# Altium project jetson-orin-baseboard.PrjPcb (part 1 of 5)
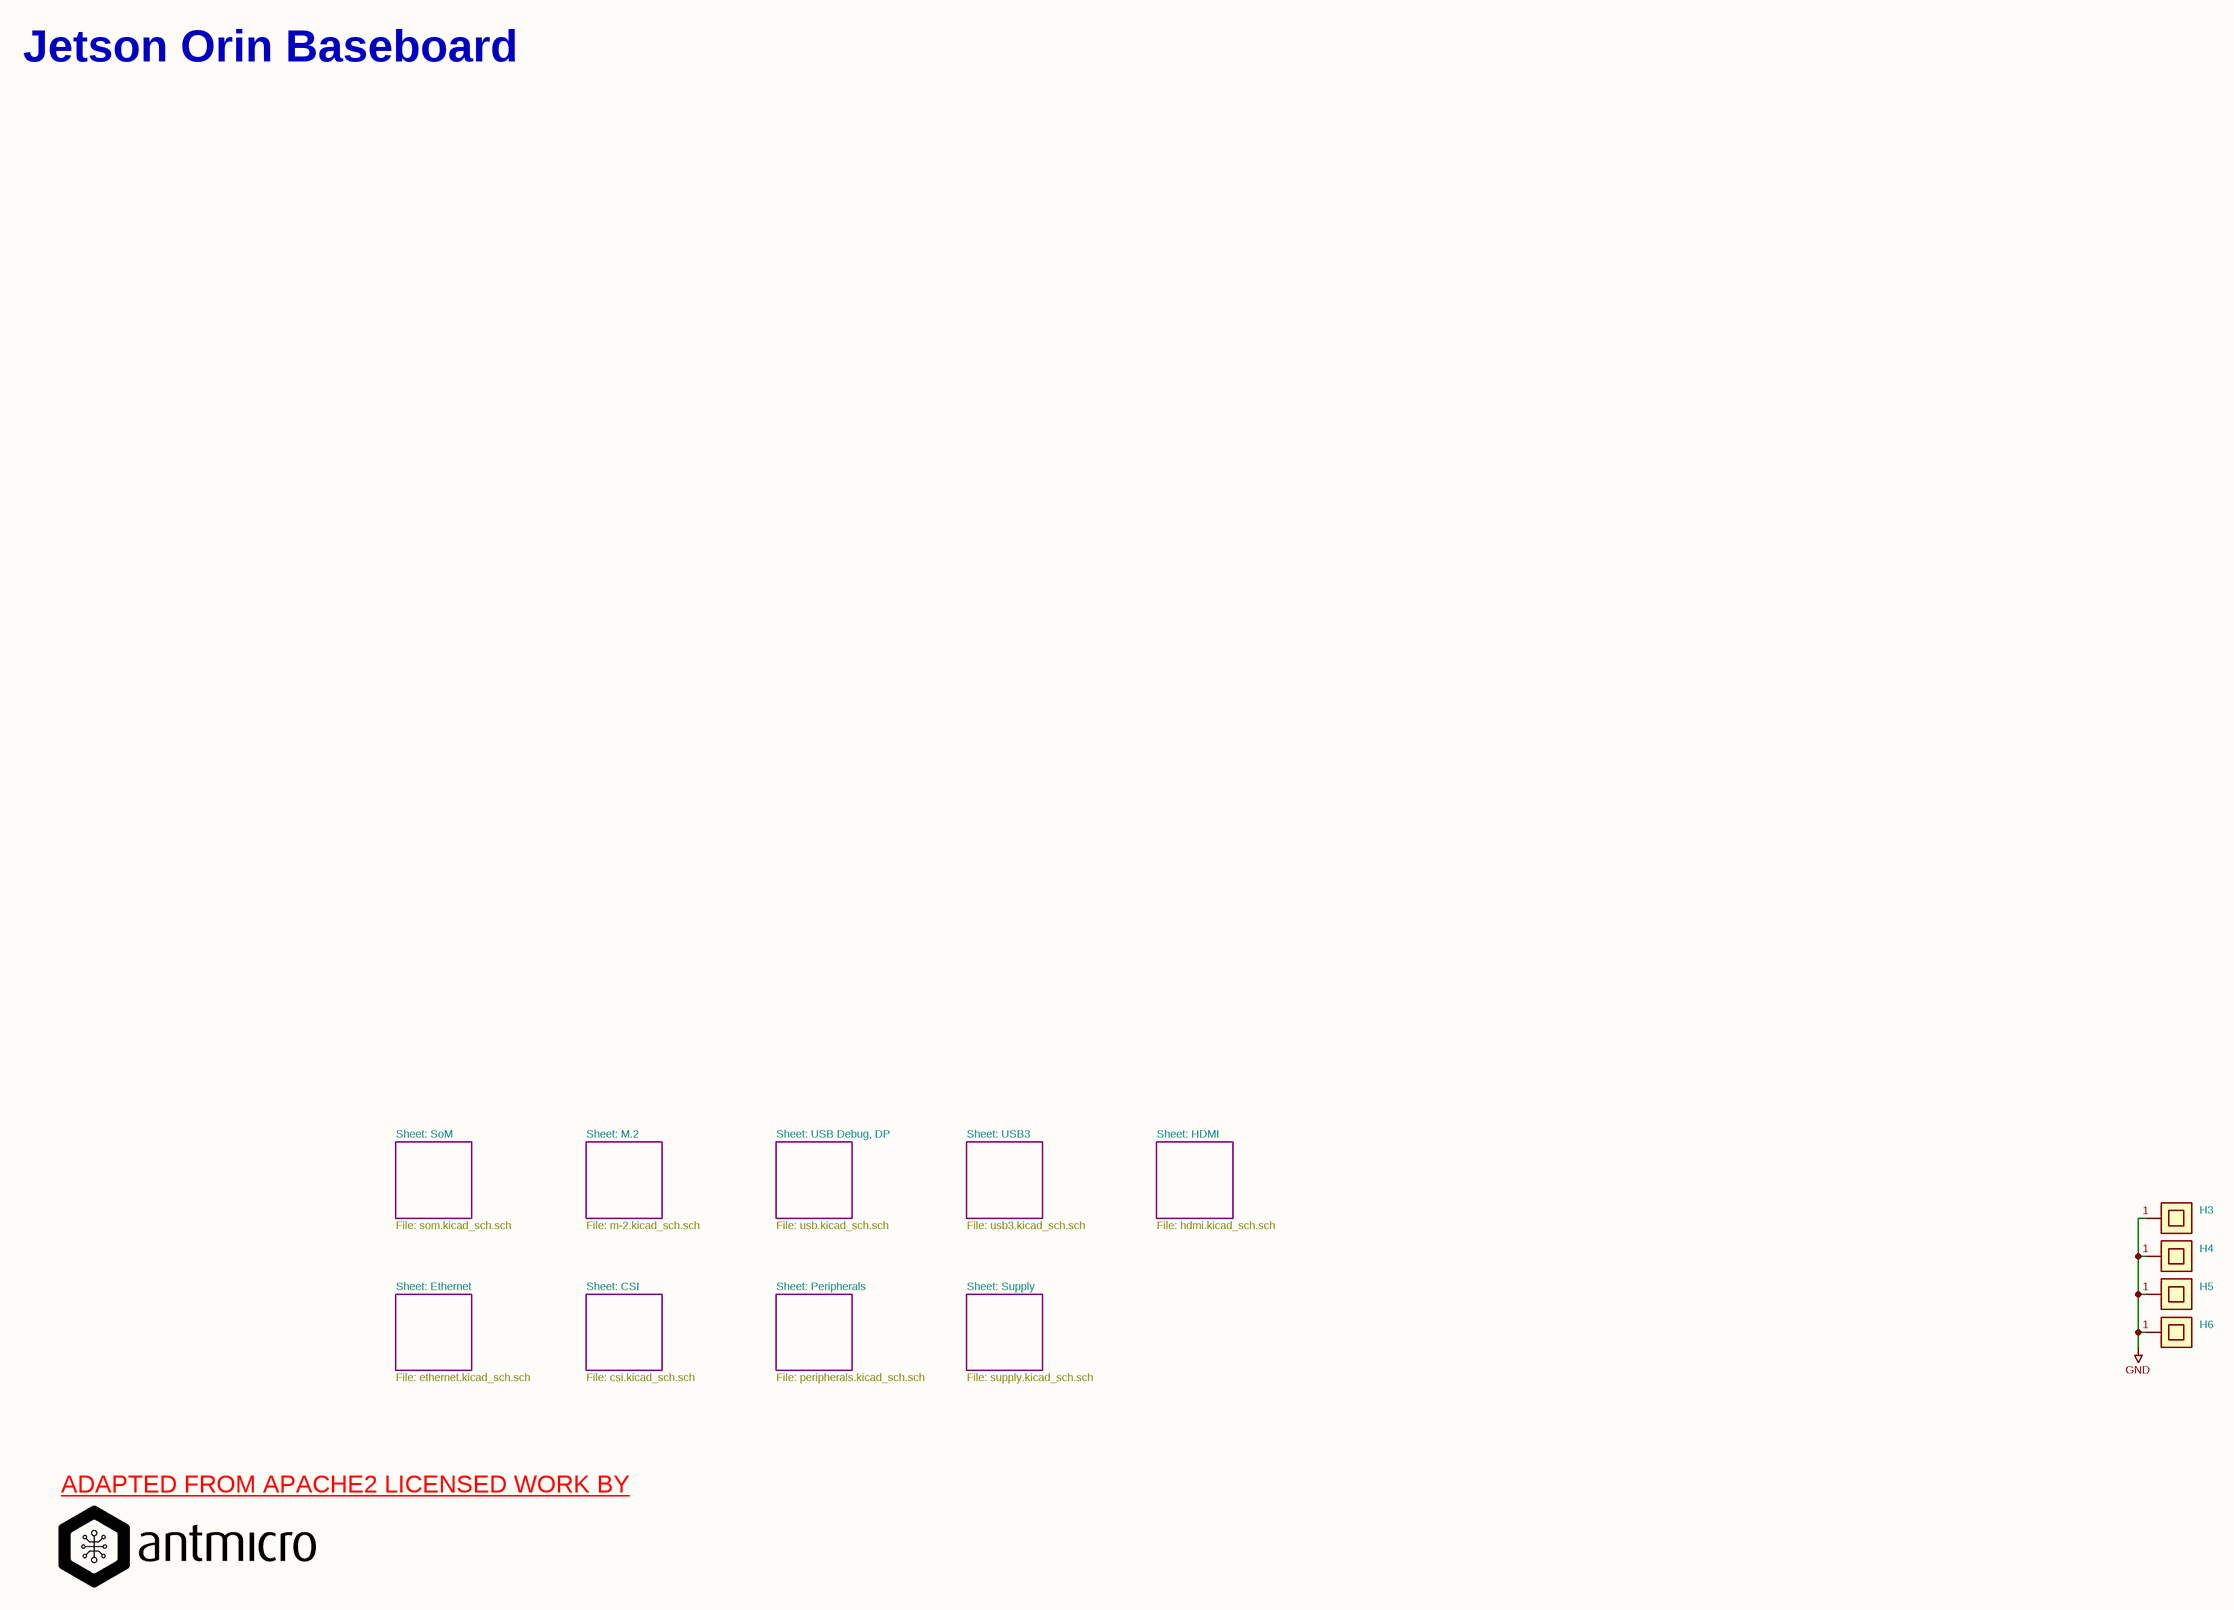
[diagram p0: jetson-orin-baseboard.SchDoc]
10 sheets, 674 parts. Net scope: flat (ports and power ports of the same name join across sheets).
Board file: jetson-orin-baseboard.PcbDoc
Sheets:
  jetson-orin-baseboard.SchDoc
    HDMI = hdmi.SchDoc
    USB3 = usb3.SchDoc
    Supply = supply.SchDoc
    SoM = som.SchDoc
    CSI = csi.SchDoc
    M.2 = m-2.SchDoc
    Ethernet = ethernet.SchDoc
    Peripherals = peripherals.SchDoc
    USB Debug, DP = usb.SchDoc

## Sheet jetson-orin-baseboard.SchDoc
size 420 x 297 mm

### Parts
H3  9774065151R  [Spacer_Drill3.7mm_H6.5mm_9774065151R]  (value not drawn)
H4  9774065151R  [Spacer_Drill3.7mm_H6.5mm_9774065151R]  (value not drawn)
H5  9774065151R  [Spacer_Drill3.7mm_H6.5mm_9774065151R]  (value not drawn)
H6  9774065151R  [Spacer_Drill3.7mm_H6.5mm_9774065151R]  (value not drawn)

### Sub-sheets
CSI = csi.SchDoc: no entries
Ethernet = ethernet.SchDoc: no entries
HDMI = hdmi.SchDoc: no entries
M.2 = m-2.SchDoc: no entries
Peripherals = peripherals.SchDoc: no entries
SoM = som.SchDoc: no entries
Supply = supply.SchDoc: no entries
USB3 = usb3.SchDoc: no entries
USB Debug, DP = usb.SchDoc: no entries

### Nets
GND: H3.1 H4.1 H5.1 H6.1

### Notes on the sheet
- Jetson Orin Baseboard
- Sheet: SoM
- Sheet: M.2
- Sheet: USB Debug, DP
- Sheet: USB3
- Sheet: HDMI
- File: som.kicad_sch.sch
- File: m-2.kicad_sch.sch
- File: usb.kicad_sch.sch
- File: usb3.kicad_sch.sch
- File: hdmi.kicad_sch.sch
- Sheet: Ethernet
- Sheet: CSI
- Sheet: Peripherals
- Sheet: Supply
- File: ethernet.kicad_sch.sch
- File: csi.kicad_sch.sch
- File: peripherals.kicad_sch.sch
- File: supply.kicad_sch.sch
- ADAPTED FROM APACHE2 LICENSED WORK BY <https://github.com/antmicro/jetson-orin-baseboard>
- 1
- 2
- 3
- 4
- 5
- 6
- 7
- 8
- A
- B
- C
- D
- E
- www.antmicro.com <http://www.antmicro.com>
- Title: Jetson Orin Baseboard
- File: jetson-orin-baseboard.kicad_sch
- Sheet: /
- Antmicro Ltd
- F
- KiCad E.D.A.  kicad (5.1.4)-1
- Size: A3
- Date: 2025-01-15
- Rev: 1.3.0
- Id: 1/1

### Library data of the parts
H3-H6 = Spacer_Drill3.7mm_H6.5mm_9774065151R: Manufacturer 1: Würth Elektronik; License: Apache-2.0; Author: Antmicro; OldValue: Spacer_Drill3.7mm_H6.5mm_9774065151R; Manufacturer Part Number 1: 9774065151R; Value: 9774065151R; Footprint: antmicro-footprints:Spacer_Drill3.7mm_H6.5mm_9774065151R

## Sheet hdmi.SchDoc
size 420 x 297 mm
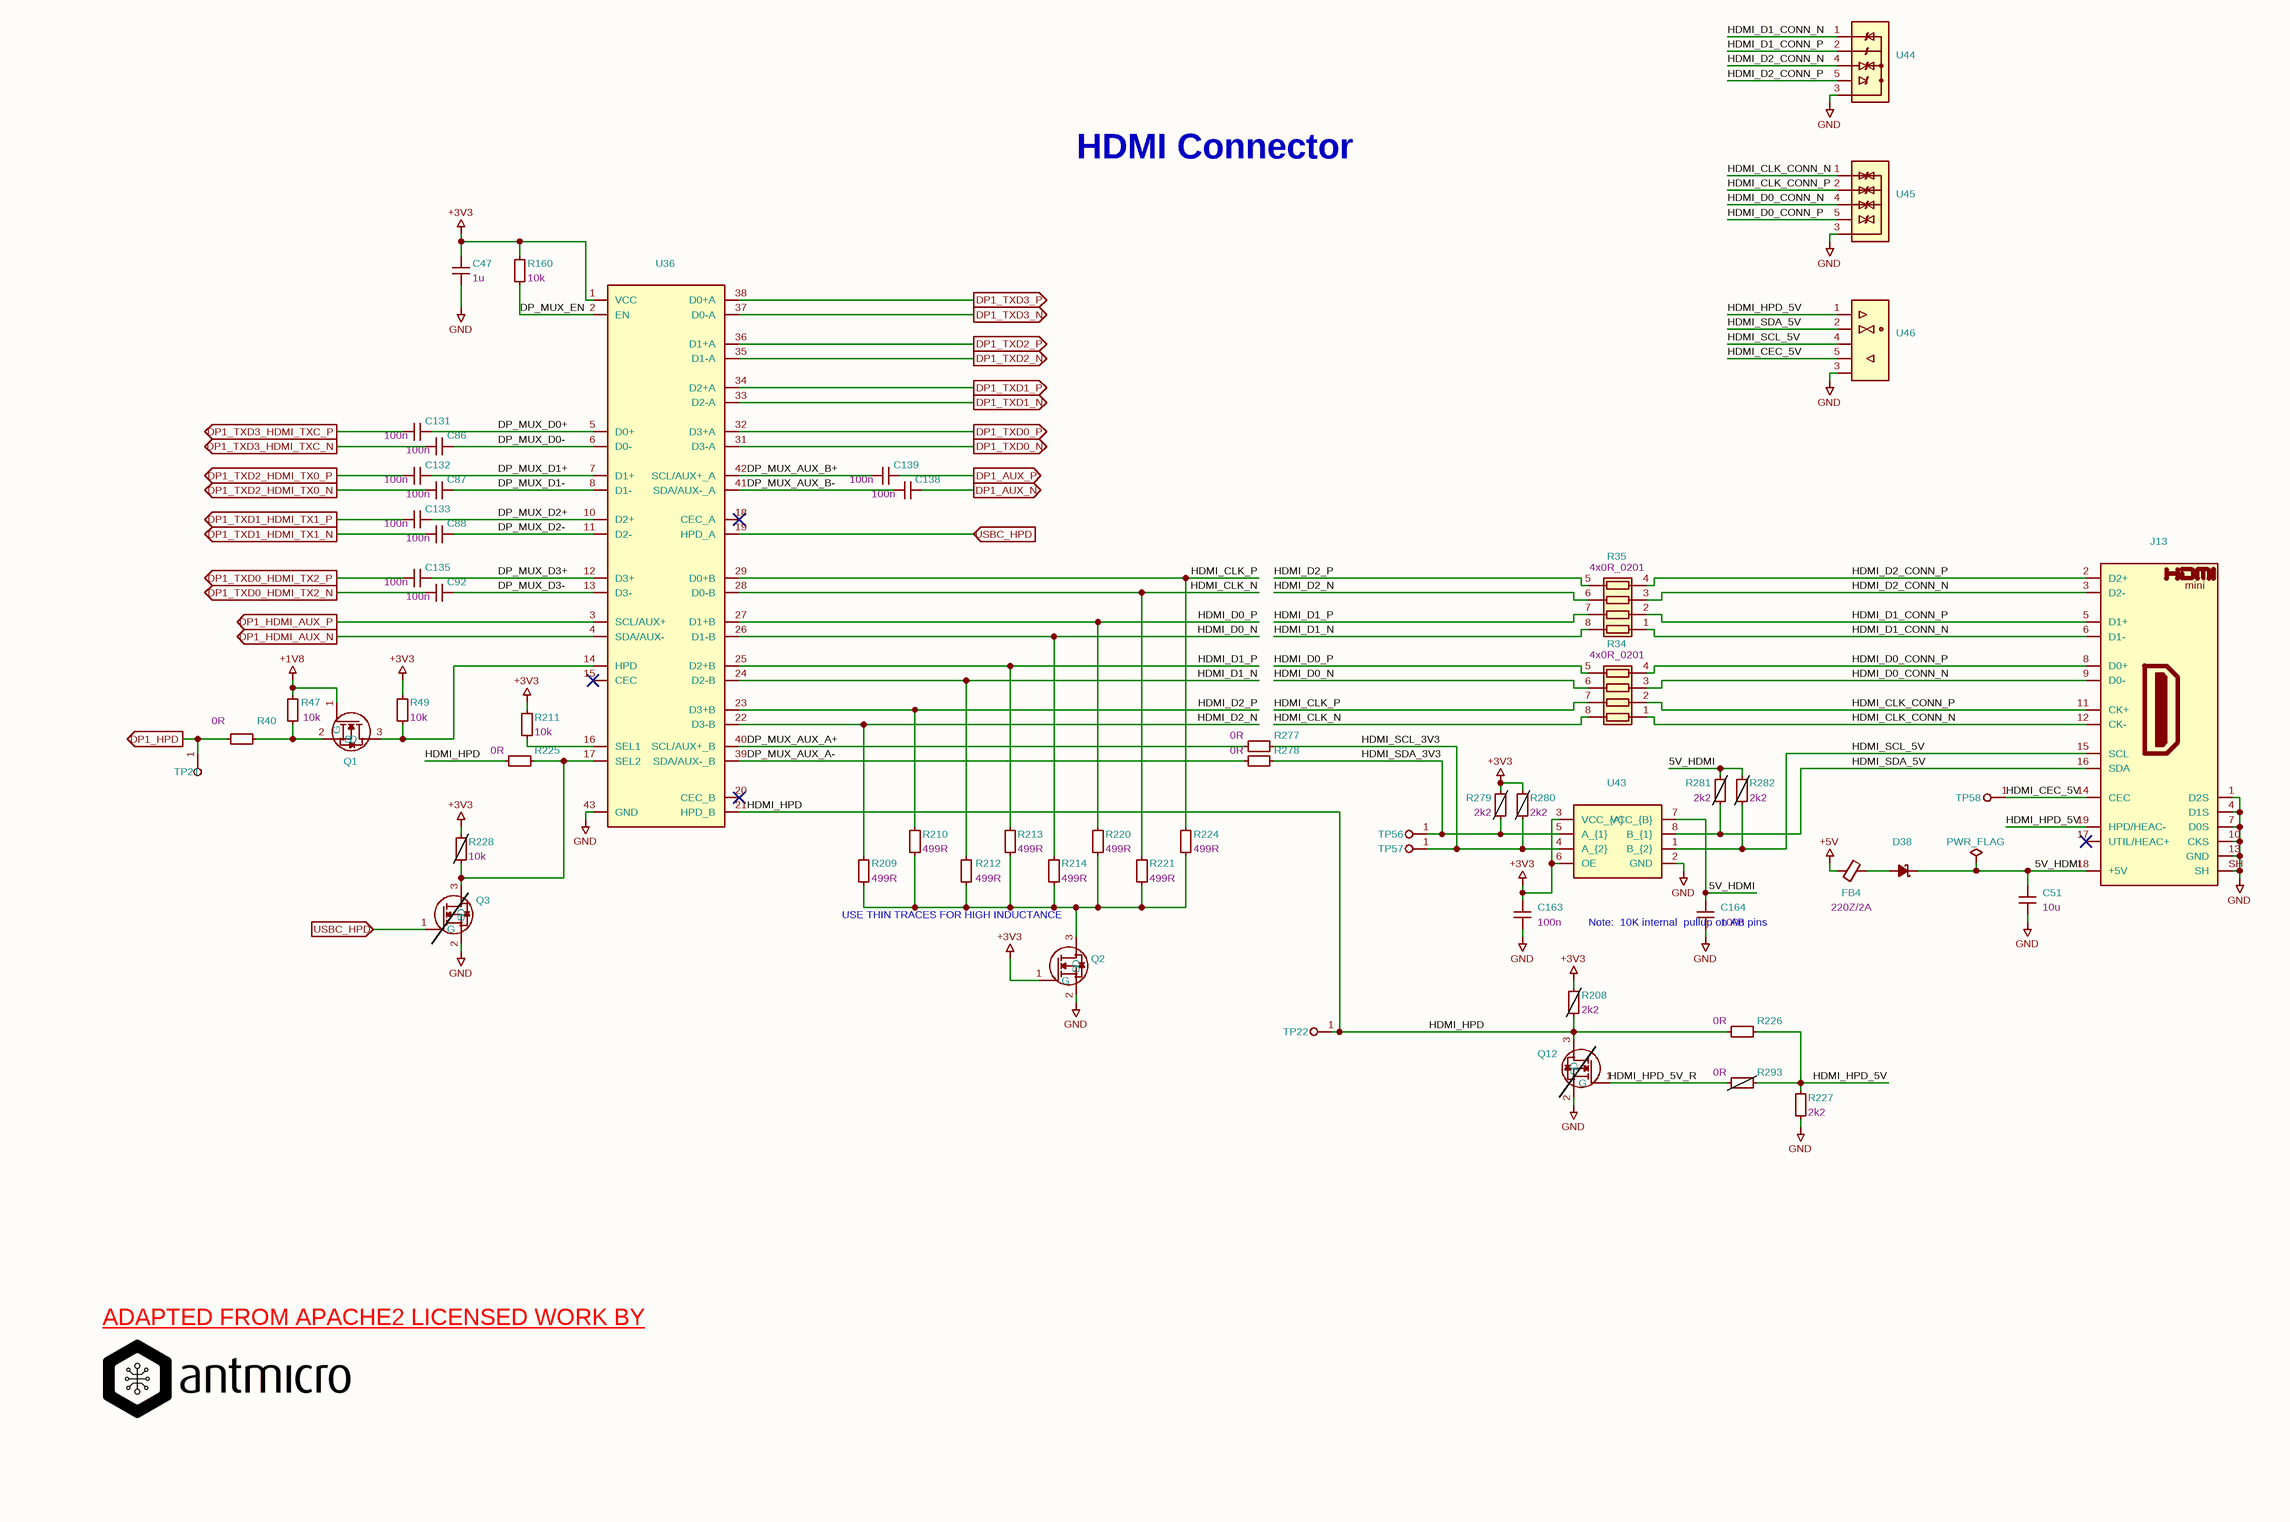
[diagram p1: hdmi.SchDoc]

### Parts
#FLG08  PWR_FLAG  (graphical)
C47  Val: 1u  [C_0402_1005Metric]  (hidden comment: C1005X6S1A105K050BC)
C51  Val: 10u  [C_0603_1608Metric]  (hidden comment: GRM188R61A106KE69D)
C86  Val: 100n  [C_0402_1005Metric]  (hidden comment: GRM155R61H104KE14D)
C87  Val: 100n  [C_0402_1005Metric]  (hidden comment: GRM155R61H104KE14D)
C88  Val: 100n  [C_0402_1005Metric]  (hidden comment: GRM155R61H104KE14D)
C92  Val: 100n  [C_0402_1005Metric]  (hidden comment: GRM155R61H104KE14D)
C131  Val: 100n  [C_0402_1005Metric]  (hidden comment: GRM155R61H104KE14D)
C132  Val: 100n  [C_0402_1005Metric]  (hidden comment: GRM155R61H104KE14D)
C133  Val: 100n  [C_0402_1005Metric]  (hidden comment: GRM155R61H104KE14D)
C135  Val: 100n  [C_0402_1005Metric]  (hidden comment: GRM155R61H104KE14D)
C138  Val: 100n  [C_0402_1005Metric]  (hidden comment: GRM155R61H104KE14D)
C139  Val: 100n  [C_0402_1005Metric]  (hidden comment: GRM155R61H104KE14D)
C163  Val: 100n  [C_0402_1005Metric]  (hidden comment: GRM155R61H104KE14D)
C164  Val: 100n  [C_0402_1005Metric]  (hidden comment: GRM155R61H104KE14D)
D38  RB521S30T1G  [SOD-523]  (value not drawn)
FB4  Val: 220Z/2A  [FB_0805_2012Metric]  (hidden comment: BLM21PG221SN1D)
J13  685119136923  [HDMI-Mini-C_Receptacle_WE_685119136923]  (value not drawn)
Q1  PJE138K_R1_00001  [SOT-523]  (value not drawn)
Q2  PJE138K_R1_00001  [SOT-523]  (value not drawn)
Q3  PJE138K_R1_00001  [SOT-523]  (value not drawn)  (no BOM)
Q12  PJE138K_R1_00001  [SOT-523]  (value not drawn)  (no BOM)
R34  Val: 4x0R_0201  [R_Array_4x0201_Panasonic_EXB18V]  (hidden comment: EXB-18VR000X)
R35  Val: 4x0R_0201  [R_Array_4x0201_Panasonic_EXB18V]  (hidden comment: EXB-18VR000X)
R40  Val: 0R  [R_0402_1005Metric]  (hidden comment: ERJ2GE0R00X)
R47  Val: 10k  [R_0402_1005Metric]  (hidden comment: CR0402-FX-1002GLF)
R49  Val: 10k  [R_0402_1005Metric]  (hidden comment: CR0402-FX-1002GLF)
R160  Val: 10k  [R_0402_1005Metric]  (hidden comment: CR0402-FX-1002GLF)
R208  Val: 2k2  [R_0402_1005Metric]  (hidden comment: CR0402-FX-2201GLF)  (no BOM)
R209  Val: 499R  [R_0402_1005Metric]  (hidden comment: CR0402-FX-4990GLF)
R210  Val: 499R  [R_0402_1005Metric]  (hidden comment: CR0402-FX-4990GLF)
R211  Val: 10k  [R_0402_1005Metric]  (hidden comment: CR0402-FX-1002GLF)
R212  Val: 499R  [R_0402_1005Metric]  (hidden comment: CR0402-FX-4990GLF)
R213  Val: 499R  [R_0402_1005Metric]  (hidden comment: CR0402-FX-4990GLF)
R214  Val: 499R  [R_0402_1005Metric]  (hidden comment: CR0402-FX-4990GLF)
R220  Val: 499R  [R_0402_1005Metric]  (hidden comment: CR0402-FX-4990GLF)
R221  Val: 499R  [R_0402_1005Metric]  (hidden comment: CR0402-FX-4990GLF)
R224  Val: 499R  [R_0402_1005Metric]  (hidden comment: CR0402-FX-4990GLF)
R225  Val: 0R  [R_0402_1005Metric]  (hidden comment: ERJ2GE0R00X)
R226  Val: 0R  [R_0402_1005Metric]  (hidden comment: ERJ2GE0R00X)
R227  Val: 2k2  [R_0402_1005Metric]  (hidden comment: CR0402-FX-2201GLF)
R228  Val: 10k  [R_0402_1005Metric]  (hidden comment: CR0402-FX-1002GLF)  (no BOM)
R277  Val: 0R  [R_0402_1005Metric]  (hidden comment: ERJ2GE0R00X)
R278  Val: 0R  [R_0402_1005Metric]  (hidden comment: ERJ2GE0R00X)
R279  Val: 2k2  [R_0402_1005Metric]  (hidden comment: CR0402-FX-2201GLF)  (no BOM)
R280  Val: 2k2  [R_0402_1005Metric]  (hidden comment: CR0402-FX-2201GLF)  (no BOM)
R281  Val: 2k2  [R_0402_1005Metric]  (hidden comment: CR0402-FX-2201GLF)  (no BOM)
R282  Val: 2k2  [R_0402_1005Metric]  (hidden comment: CR0402-FX-2201GLF)  (no BOM)
R293  Val: 0R  [R_0402_1005Metric]  (hidden comment: ERJ2GE0R00X)  (no BOM)
TP21  TP_0.75mm_SMD  [TP_SMD_0.75mm]  (value not drawn)  (no BOM)
TP22  TP_0.75mm_SMD  [TP_SMD_0.75mm]  (value not drawn)  (no BOM)
TP56  TP_0.75mm_SMD  [TP_SMD_0.75mm]  (value not drawn)  (no BOM)
TP57  TP_0.75mm_SMD  [TP_SMD_0.75mm]  (value not drawn)  (no BOM)
TP58  TP_0.75mm_SMD  [TP_SMD_0.75mm]  (value not drawn)  (no BOM)
U36  TS3DV642RUARQ1  [WQFN-42-1EP_3.5x9mm_P0.5mm]  (value not drawn)
U43  NTS0102GT  [XSON-8_1x1.95mm_P0.5mm]  (value not drawn)
U44  TPD4E05U06QDQARQ1  [USON-10_2.5x1mm_P0.5mm]  (value not drawn)
U45  TPD4E05U06QDQARQ1  [USON-10_2.5x1mm_P0.5mm]  (value not drawn)
U46  TPD4E05U06QDQARQ1  [USON-10_2.5x1mm_P0.5mm]  (value not drawn)

### Ports
DP1_AUX_N (out), DP1_AUX_P (out), DP1_HDMI_AUX_N (out), DP1_HDMI_AUX_P (out), DP1_HPD (out), DP1_TXD0_HDMI_TX2_N (out), DP1_TXD0_HDMI_TX2_P (out), DP1_TXD0_N (out), DP1_TXD0_P (out), DP1_TXD1_HDMI_TX1_N (out), DP1_TXD1_HDMI_TX1_P (out), DP1_TXD1_N (out), DP1_TXD1_P (out), DP1_TXD2_HDMI_TX0_N (out), DP1_TXD2_HDMI_TX0_P (out), DP1_TXD2_N (out), DP1_TXD2_P (out), DP1_TXD3_HDMI_TXC_N (out), DP1_TXD3_HDMI_TXC_P (out), DP1_TXD3_N (out), DP1_TXD3_P (out), USBC_HPD (in)

### Nets
+1V8: Q1.1(G) R47.2
+3V3: C47.2 C163.2 Q2.1(G) R49.2 R160.2 R208.2 R211.2 R228.2 R279.2 R280.2 U36.1(VCC) U43.3(VCC_{A}) U43.6(OE)
+5V: FB4.1
GND: C47.1 C51.2 C163.1 C164.1 J13.1(D2S) J13.4(D1S) J13.7(D0S) J13.10(CKS) J13.13(GND) J13.SH Q2.2(S) Q3.2(S) Q12.2(S) R227.1 U36.43(GND) U43.2(GND) U44.3 U45.3 U46.3
5V_HDMI: #FLG08.1(pwr) C51.1 C164.2 D38.1(C) J13.18(+5V) R281.2 R282.2 U43.7(VCC_{B})
DP1_AUX_N: C138.1 ; port DP1_AUX_N
DP1_AUX_P: C139.1 ; port DP1_AUX_P
DP1_HDMI_AUX_N: U36.4(SDA/AUX-) ; port DP1_HDMI_AUX_N
DP1_HDMI_AUX_P: U36.3(SCL/AUX+) ; port DP1_HDMI_AUX_P
DP1_HPD: R40.2 TP21.1 ; port DP1_HPD
DP1_TXD0_HDMI_TX2_N: C92.2 ; port DP1_TXD0_HDMI_TX2_N
DP1_TXD0_HDMI_TX2_P: C135.2 ; port DP1_TXD0_HDMI_TX2_P
DP1_TXD0_N: U36.31(D3-A) ; port DP1_TXD0_N
DP1_TXD0_P: U36.32(D3+A) ; port DP1_TXD0_P
DP1_TXD1_HDMI_TX1_N: C88.2 ; port DP1_TXD1_HDMI_TX1_N
DP1_TXD1_HDMI_TX1_P: C133.2 ; port DP1_TXD1_HDMI_TX1_P
DP1_TXD1_N: U36.33(D2-A) ; port DP1_TXD1_N
DP1_TXD1_P: U36.34(D2+A) ; port DP1_TXD1_P
DP1_TXD2_HDMI_TX0_N: C87.2 ; port DP1_TXD2_HDMI_TX0_N
DP1_TXD2_HDMI_TX0_P: C132.2 ; port DP1_TXD2_HDMI_TX0_P
DP1_TXD2_N: U36.35(D1-A) ; port DP1_TXD2_N
DP1_TXD2_P: U36.36(D1+A) ; port DP1_TXD2_P
DP1_TXD3_HDMI_TXC_N: C86.2 ; port DP1_TXD3_HDMI_TXC_N
DP1_TXD3_HDMI_TXC_P: C131.2 ; port DP1_TXD3_HDMI_TXC_P
DP1_TXD3_N: U36.37(D0-A) ; port DP1_TXD3_N
DP1_TXD3_P: U36.38(D0+A) ; port DP1_TXD3_P
DP_MUX_AUX_A+: R277.1 U36.40(SCL/AUX+_B)
DP_MUX_AUX_A-: R278.1 U36.39(SDA/AUX-_B)
DP_MUX_AUX_B+: C139.2 U36.42(SCL/AUX+_A)
DP_MUX_AUX_B-: C138.2 U36.41(SDA/AUX-_A)
DP_MUX_D0+: C131.1 U36.5(D0+)
DP_MUX_D0-: C86.1 U36.6(D0-)
DP_MUX_D1+: C132.1 U36.7(D1+)
DP_MUX_D1-: C87.1 U36.8(D1-)
DP_MUX_D2+: C133.1 U36.10(D2+)
DP_MUX_D2-: C88.1 U36.11(D2-)
DP_MUX_D3+: C135.1 U36.12(D3+)
DP_MUX_D3-: C92.1 U36.13(D3-)
DP_MUX_EN: R160.1 U36.2(EN)
HDMI_CEC_5V: J13.14(CEC) TP58.1 U46.5
HDMI_CLK_CONN_N: J13.12(CK-) R34.1(R1.1) U45.1
HDMI_CLK_CONN_P: J13.11(CK+) R34.2(R2.1) U45.2
HDMI_CLK_N: R34.8(R1.2) R221.2 U36.28(D0-B)
HDMI_CLK_P: R34.7(R2.2) R224.2 U36.29(D0+B)
HDMI_D0_CONN_N: J13.9(D0-) R34.3(R3.1) U45.4
HDMI_D0_CONN_P: J13.8(D0+) R34.4(R4.1) U45.5
HDMI_D0_N: R34.6(R3.2) R214.2 U36.26(D1-B)
HDMI_D0_P: R34.5(R4.2) R220.2 U36.27(D1+B)
HDMI_D1_CONN_N: J13.6(D1-) R35.1(R1.1) U44.1
HDMI_D1_CONN_P: J13.5(D1+) R35.2(R2.1) U44.2
HDMI_D1_N: R35.8(R1.2) R212.2 U36.24(D2-B)
HDMI_D1_P: R35.7(R2.2) R213.2 U36.25(D2+B)
HDMI_D2_CONN_N: J13.3(D2-) R35.3(R3.1) U44.4
HDMI_D2_CONN_P: J13.2(D2+) R35.4(R4.1) U44.5
HDMI_D2_N: R35.6(R3.2) R209.2 U36.22(D3-B)
HDMI_D2_P: R35.5(R4.2) R210.2 U36.23(D3+B)
HDMI_HPD: Q12.3(D) R208.1 R225.1 R226.1 TP22.1 U36.21(HPD_B)
HDMI_HPD_5V: J13.19(HPD/HEAC-) R226.2 R227.2 R293.2 U46.1
HDMI_HPD_5V_R: Q12.1(G) R293.1
HDMI_SCL_3V3: R277.2 R280.1 TP57.1 U43.4(A_{2})
HDMI_SCL_5V: J13.15(SCL) R282.1 U43.1(B_{2}) U46.4
HDMI_SDA_3V3: R278.2 R279.1 TP56.1 U43.5(A_{1})
HDMI_SDA_5V: J13.16(SDA) R281.1 U43.8(B_{1}) U46.2
USBC_HPD: Q3.1(G) U36.19(HPD_A) ; port USBC_HPD
NetD38_2: D38.2(A) FB4.2
NetQ1_2: Q1.2(S) R40.1 R47.1
NetQ1_3: Q1.3(D) R49.1 U36.14(HPD)
NetQ2_3: Q2.3(D) R209.1 R210.1 R212.1 R213.1 R214.1 R220.1 R221.1 R224.1
NetQ3_3: Q3.3(D) R225.2 R228.1 U36.17(SEL2)
NetR211_1: R211.1 U36.16(SEL1)

Not connected (* = marked no-connect by the designer): J13 17(UTIL/HEAC+)*; U36 9(NC) 15(CEC)* 18(CEC_A)* 20(CEC_B)* 30(NC); U44 6 7 8 9 10; U45 6 7 8 9 10; U46 6 7 8 9 10

### Notes on the sheet
- HDMI Connector
- USE THIN TRACES FOR HIGH INDUCTANCE
- (near C164) Note:
  10K internal
  pullup
  on AB pins
- ADAPTED FROM APACHE2 LICENSED WORK BY <https://github.com/antmicro/jetson-orin-baseboard>
- 1
- 2
- 3
- 4
- 5
- 6
- 7
- 8
- A
- B
- C
- D
- E
- www.antmicro.com <http://www.antmicro.com>
- Title: Jetson Orin Baseboard
- File: hdmi.kicad_sch
- Sheet: /
- Antmicro Ltd
- F
- KiCad E.D.A.  kicad (5.1.4)-1
- Size: A3
- Date: 2025-01-15
- Rev: 1.3.0
- Id: 1/1
- (in symbol HDMI-Mini-C_WE_685119136923) mini

### Library data of the parts
C47 = C_1u_0402: Manufacturer 1: TDK; License: Apache-2.0; Author: Antmicro; OldValue: C_1u_0402; Manufacturer Part Number 1: C1005X6S1A105K050BC; Value: C1005X6S1A105K050BC; Footprint: antmicro-footprints:C_0402_1005Metric
C51 = C_10u_0603: Manufacturer 1: Murata; License: Apache-2.0; Dielectric: template_dielectric; Author: Antmicro; OldValue: C_10u_0603; Manufacturer Part Number 1: GRM188R61A106KE69D; Value: GRM188R61A106KE69D; Footprint: antmicro-footprints:C_0603_1608Metric
C86-C88 C92 C131-C133 C135 C138 C139 C163 C164 = C_100n_0402: Manufacturer 1: Murata; License: Apache-2.0; Voltage: 50V; Dielectric: X5R; Author: Antmicro; OldValue: C_100n_0402; Manufacturer Part Number 1: GRM155R61H104KE14D; Value: GRM155R61H104KE14D; Footprint: antmicro-footprints:C_0402_1005Metric
D38 = RB521S30T1G: Manufacturer 1: ON Semiconductor; License: Apache-2.0; Author: Antmicro; OldValue: RB521S30T1G; Manufacturer Part Number 1: RB521S30T1G; Value: RB521S30T1G; Footprint: antmicro-footprints:SOD-523
FB4 = FB_220Z_2A_Murata-BLM21PG_0805: Manufacturer 1: Murata; License: Apache-2.0; Author: Antmicro; OldValue: FB_220Z_2A_Murata-BLM21PG_0805; Manufacturer Part Number 1: BLM21PG221SN1D; Value: BLM21PG221SN1D; Footprint: antmicro-footprints:FB_0805_2012Metric
J13 = HDMI-Mini-C_WE_685119136923: Manufacturer 1: Würth Elektronik; License: Apache-2.0; Author: Antmicro; OldValue: HDMI-Mini-C_WE_685119136923; Manufacturer Part Number 1: 685119136923; Value: 685119136923; Footprint: antmicro-footprints:HDMI-Mini-C_Receptacle_WE_685119136923
Q1-Q3 Q12 = PJE138K: Manufacturer 1: PANJIT; License: Apache-2.0; Author: Antmicro; OldValue: PJE138K; Manufacturer Part Number 1: PJE138K_R1_00001; Value: PJE138K_R1_00001; Footprint: antmicro-footprints:SOT-523
R34 R35 = R_4x0R_0201_array: Manufacturer 1: Panasonic; License: Apache-2.0; Author: Antmicro; OldValue: R_4x0R_0201_array; Manufacturer Part Number 1: EXB-18VR000X; Value: EXB-18VR000X; Footprint: antmicro-footprints:R_Array_4x0201_Panasonic_EXB18V
R40 R225 R226 R277 R278 R293 = R_0R_0402: Manufacturer 1: Panasonic; License: Apache-2.0; Tolerance: ~; Current: 1A; Author: Antmicro; OldValue: R_0R_0402; Manufacturer Part Number 1: ERJ2GE0R00X; Value: ERJ2GE0R00X; Footprint: antmicro-footprints:R_0402_1005Metric
R47 R49 R160 R211 R228 = R_10k_0402: Manufacturer 1: Bourns; License: Apache-2.0; Tolerance: 1%; Author: Antmicro; OldValue: R_10k_0402; Manufacturer Part Number 1: CR0402-FX-1002GLF; Value: CR0402-FX-1002GLF; Footprint: antmicro-footprints:R_0402_1005Metric
R208 R227 R279-R282 = R_2k2_0402: Manufacturer 1: Bourns; License: Apache-2.0; Tolerance: 1%; Author: Antmicro; OldValue: R_2k2_0402; Manufacturer Part Number 1: CR0402-FX-2201GLF; Value: CR0402-FX-2201GLF; Footprint: antmicro-footprints:R_0402_1005Metric
R209 R210 R212-R214 R220 R221 R224 = R_499R_0402: Manufacturer 1: Bourns; License: Apache-2.0; Tolerance: 1%; Author: Antmicro; OldValue: R_499R_0402; Manufacturer Part Number 1: CR0402-FX-4990GLF; Value: CR0402-FX-4990GLF; Footprint: antmicro-footprints:R_0402_1005Metric
TP21 TP22 TP56-TP58 = TP_0.75mm_SMD: License: Apache-2.0; Author: Antmicro; OldValue: TP_0.75mm_SMD; Value: TP_0.75mm_SMD; Footprint: antmicro-footprints:TP_SMD_0.75mm
U36 = TS3DV642RUARQ1: Manufacturer 1: Texas Instruments; License: Apache-2.0; Author: Antmicro; OldValue: TS3DV642RUARQ1; Manufacturer Part Number 1: TS3DV642RUARQ1; Value: TS3DV642RUARQ1; Footprint: antmicro-footprints:WQFN-42-1EP_3.5x9mm_P0.5mm
U43 = NTS0102_XSON: Manufacturer 1: NXP; License: Apache-2.0; Author: Antmicro; OldValue: NTS0102_XSON; Manufacturer Part Number 1: NTS0102GT; Value: NTS0102GT; Footprint: antmicro-footprints:XSON-8_1x1.95mm_P0.5mm
U44-U46 = TPD4E05U06QDQARQ1: Manufacturer 1: Texas Instruments; License: Apache-2.0; Author: Antmicro; OldValue: TPD4E05U06QDQARQ1; Manufacturer Part Number 1: TPD4E05U06QDQARQ1; Value: TPD4E05U06QDQARQ1; Footprint: antmicro-footprints:USON-10_2.5x1mm_P0.5mm
#FLG08 = PWR_FLAG: Value: PWR_FLAG

## Sheet usb3.SchDoc
size 420 x 297 mm
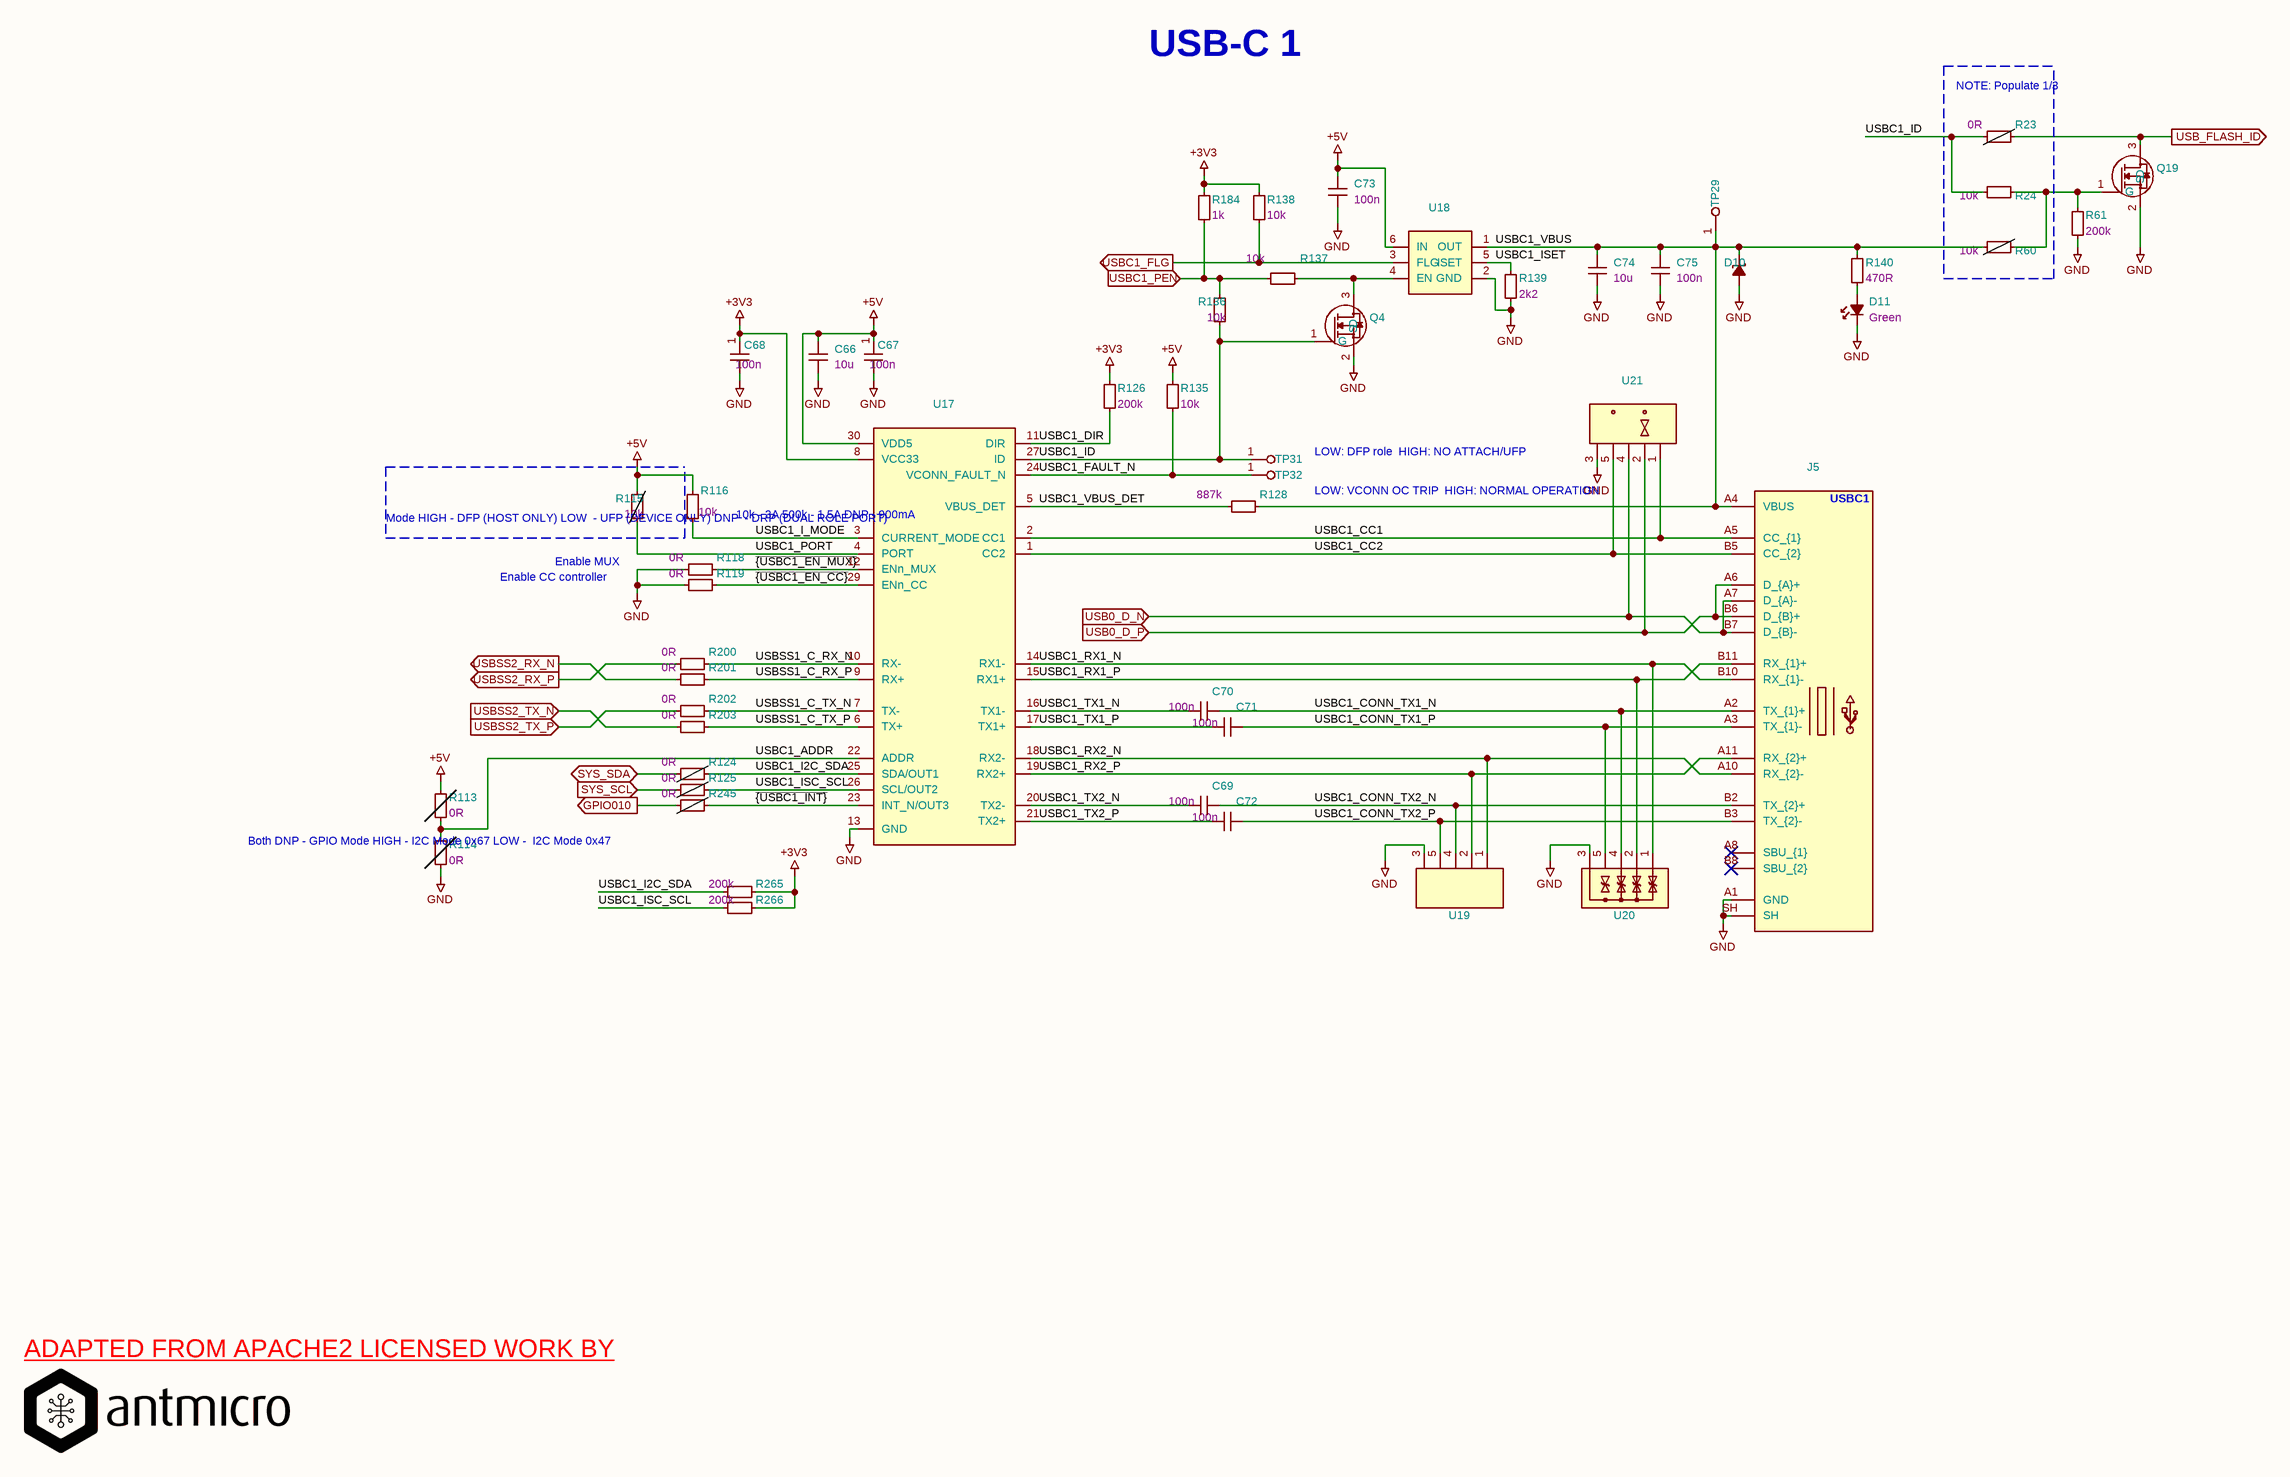
[diagram p2: usb3.SchDoc]

### Parts
C66  Val: 10u  [C_0603_1608Metric]  (hidden comment: GRM188R61A106KE69D)
C67  Val: 100n  [C_0402_1005Metric]  (hidden comment: GRM155R61H104KE14D)
C68  Val: 100n  [C_0402_1005Metric]  (hidden comment: GRM155R61H104KE14D)
C69  Val: 100n  [C_0402_1005Metric]  (hidden comment: GRM155R61H104KE14D)
C70  Val: 100n  [C_0402_1005Metric]  (hidden comment: GRM155R61H104KE14D)
C71  Val: 100n  [C_0402_1005Metric]  (hidden comment: GRM155R61H104KE14D)
C72  Val: 100n  [C_0402_1005Metric]  (hidden comment: GRM155R61H104KE14D)
C73  Val: 100n  [C_0402_1005Metric]  (hidden comment: GRM155R61H104KE14D)
C74  Val: 10u  [C_0603_1608Metric]  (hidden comment: GRM188R61A106KE69D)
C75  Val: 100n  [C_0402_1005Metric]  (hidden comment: GRM155R61H104KE14D)
D10  ESD9X5.0ST5G  [SOD-923]  (value not drawn)
D11  Color: Green  [LED_0603_1608Metric_G]  (hidden comment: LTST-C190GKT)
J5  632723300011  [USB-C_Receptacle_WE_632723300011]  (value not drawn)
Q4  PJE138K_R1_00001  [SOT-523]  (value not drawn)
Q19  PJE138K_R1_00001  [SOT-523]  (value not drawn)
R23  Val: 0R  [R_0402_1005Metric]  (hidden comment: ERJ2GE0R00X)  (no BOM)
R24  Val: 10k  [R_0402_1005Metric]  (hidden comment: CR0402-FX-1002GLF)
R60  Val: 10k  [R_0402_1005Metric]  (hidden comment: CR0402-FX-1002GLF)  (no BOM)
R61  Val: 200k  [R_0402_1005Metric]  (hidden comment: CR0402-FX-2003GLF)
R113  Val: 0R  [R_0402_1005Metric]  (hidden comment: ERJ2GE0R00X)  (no BOM)
R114  Val: 0R  [R_0402_1005Metric]  (hidden comment: ERJ2GE0R00X)  (no BOM)
R115  Val: 10k  [R_0402_1005Metric]  (hidden comment: CR0402-FX-1002GLF)  (no BOM)
R116  Val: 10k  [R_0402_1005Metric]  (hidden comment: CR0402-FX-1002GLF)
R118  Val: 0R  [R_0402_1005Metric]  (hidden comment: ERJ2GE0R00X)
R119  Val: 0R  [R_0402_1005Metric]  (hidden comment: ERJ2GE0R00X)
R124  Val: 0R  [R_0402_1005Metric]  (hidden comment: ERJ2GE0R00X)  (no BOM)
R125  Val: 0R  [R_0402_1005Metric]  (hidden comment: ERJ2GE0R00X)  (no BOM)
R126  Val: 200k  [R_0402_1005Metric]  (hidden comment: CR0402-FX-2003GLF)
R128  Val: 887k  [R_0402_1005Metric]  (hidden comment: ERJ-2RKF8873X)
R135  Val: 10k  [R_0402_1005Metric]  (hidden comment: CR0402-FX-1002GLF)
R136  Val: 10k  [R_0402_1005Metric]  (hidden comment: CR0402-FX-1002GLF)
R137  Val: 10k  [R_0402_1005Metric]  (hidden comment: CR0402-FX-1002GLF)
R138  Val: 10k  [R_0402_1005Metric]  (hidden comment: CR0402-FX-1002GLF)
R139  Val: 2k2  [R_0402_1005Metric]  (hidden comment: CR0402-FX-2201GLF)
R140  Val: 470R  [R_0402_1005Metric]  (hidden comment: CR0402-FX-4700GLF)
R184  Val: 1k  [R_0402_1005Metric]  (hidden comment: CR0402-FX-1001GLF)
R200  Val: 0R  [R_0402_1005Metric]  (hidden comment: ERJ2GE0R00X)
R201  Val: 0R  [R_0402_1005Metric]  (hidden comment: ERJ2GE0R00X)
R202  Val: 0R  [R_0402_1005Metric]  (hidden comment: ERJ2GE0R00X)
R203  Val: 0R  [R_0402_1005Metric]  (hidden comment: ERJ2GE0R00X)
R245  Val: 0R  [R_0402_1005Metric]  (hidden comment: ERJ2GE0R00X)  (no BOM)
R265  Val: 200k  [R_0402_1005Metric]  (hidden comment: CR0402-FX-2003GLF)
R266  Val: 200k  [R_0402_1005Metric]  (hidden comment: CR0402-FX-2003GLF)
TP29  TP_0.75mm_SMD  [TP_SMD_0.75mm]  (value not drawn)  (no BOM)
TP31  TP_0.75mm_SMD  [TP_SMD_0.75mm]  (value not drawn)  (no BOM)
TP32  TP_0.75mm_SMD  [TP_SMD_0.75mm]  (value not drawn)  (no BOM)
U17  HD3SS3220RNHT  [WQFN-30-1EP_4.6x2.6mm_P0.4mm]  (value not drawn)
U18  AP22615AWU-7  [TSOT23-6]  (value not drawn)
U19  TPD4E05U06QDQARQ1  [USON-10_2.5x1mm_P0.5mm]  (value not drawn)
U20  TPD4E05U06QDQARQ1  [USON-10_2.5x1mm_P0.5mm]  (value not drawn)
U21  TPD4E05U06QDQARQ1  [USON-10_2.5x1mm_P0.5mm]  (value not drawn)

### Blocks framed on the sheet
NOTE: / Populate 1/3: R23 R24 R60

### Ports
GPIO010 (out), SYS_SCL (in), SYS_SDA (bidir), USB0_D_N (in), USB0_D_P (in), USB_FLASH_ID (out), USBC1_FLG (out), USBC1_PEN (in), USBSS2_RX_N (out), USBSS2_RX_P (out), USBSS2_TX_N (in), USBSS2_TX_P (in)

### Nets
+3V3: C68.1 R126.2 R138.2 R184.2 R265.1 R266.1 U17.8(VCC33)
+5V: C66.1 C67.1 C73.1 R113.2 R115.1 R116.2 R135.2 U17.30(VDD5) U18.6(IN)
GND: C66.2 C67.2 C68.2 C73.2 C74.2 C75.2 D10.2(A) D11.1(C) J5.A1(GND) J5.SH Q4.2(S) Q19.2(S) R61.1 R114.1 R118.1 R119.1 R139.1 U17.13(GND) U18.2(GND) U19.3 U20.3 U21.3
GPIO010: R245.1 ; port GPIO010
SYS_SCL: R125.1 ; port SYS_SCL
SYS_SDA: R124.1 ; port SYS_SDA
USB0_D_N: J5.A7(D_{A}-) J5.B7(D_{B}-) U21.4 ; port USB0_D_N
USB0_D_P: J5.A6(D_{A}+) J5.B6(D_{B}+) U21.2 ; port USB0_D_P
USB_FLASH_ID: Q19.3(D) R23.2 ; port USB_FLASH_ID
USBC1_ADDR: R113.1 R114.2 U17.22(ADDR)
USBC1_CC1: J5.A5(CC_{1}) U17.2(CC1) U21.1
USBC1_CC2: J5.B5(CC_{2}) U17.1(CC2) U21.5
USBC1_CONN_TX1_N: C70.1 J5.A2(TX_{1}+) U20.4
USBC1_CONN_TX1_P: C71.1 J5.A3(TX_{1}-) U20.5
USBC1_CONN_TX2_N: C69.1 J5.B2(TX_{2}+) U19.4
USBC1_CONN_TX2_P: C72.1 J5.B3(TX_{2}-) U19.5
USBC1_DIR: R126.1 U17.11(DIR)
USBC1_FAULT_N: R135.1 TP32.1 U17.24(VCONN_FAULT_N)
USBC1_FLG: R138.1 U18.3(FLG) ; port USBC1_FLG
USBC1_I2C_SDA: R124.2 R265.2 U17.25(SDA/OUT1)
USBC1_I_MODE: R116.1 U17.3(CURRENT_MODE)
USBC1_ID: Q4.1(G) R23.1 R24.2 R136.2 TP31.1 U17.27(ID)
USBC1_ISC_SCL: R125.2 R266.2 U17.26(SCL/OUT2)
USBC1_ISET: R139.2 U18.5(ISET)
USBC1_PEN: R136.1 R137.2 R184.1 ; port USBC1_PEN
USBC1_PORT: R115.2 U17.4(PORT)
USBC1_RX1_N: J5.B10(RX_{1}-) U17.14(RX1-) U20.1
USBC1_RX1_P: J5.B11(RX_{1}+) U17.15(RX1+) U20.2
USBC1_RX2_N: J5.A10(RX_{2}-) U17.18(RX2-) U19.1
USBC1_RX2_P: J5.A11(RX_{2}+) U17.19(RX2+) U19.2
USBC1_TX1_N: C70.2 U17.16(TX1-)
USBC1_TX1_P: C71.2 U17.17(TX1+)
USBC1_TX2_N: C69.2 U17.20(TX2-)
USBC1_TX2_P: C72.2 U17.21(TX2+)
USBC1_VBUS: C74.1 C75.1 D10.1(C) J5.A4(VBUS) R60.2 R128.2 R140.2 TP29.1 U18.1(OUT)
USBC1_VBUS_DET: R128.1 U17.5(VBUS_DET)
USBSS1_C_RX_N: R200.2 U17.10(RX-)
USBSS1_C_RX_P: R201.2 U17.9(RX+)
USBSS1_C_TX_N: R202.2 U17.7(TX-)
USBSS1_C_TX_P: R203.2 U17.6(TX+)
USBSS2_RX_N: R201.1 ; port USBSS2_RX_N
USBSS2_RX_P: R200.1 ; port USBSS2_RX_P
USBSS2_TX_N: R203.1 ; port USBSS2_TX_N
USBSS2_TX_P: R202.1 ; port USBSS2_TX_P
~{{USBC1_EN_CC}}: R119.2 U17.29(ENn_CC)
~{{USBC1_EN_MUX}}: R118.2 U17.12(ENn_MUX)
~{{USBC1_INT}}: R245.2 U17.23(INT_N/OUT3)
NetD11_2: D11.2(A) R140.1
NetQ4_3: Q4.3(D) R137.1 U18.4(EN)
NetQ19_1: Q19.1(G) R24.1 R60.1 R61.2

Not connected (* = marked no-connect by the designer): J5 A8(SBU_{1})* A9(VBUS) A12(GND) B1(GND) B4(VBUS) B8(SBU_{2})* B9(VBUS) B12(GND); U17 28(GND) 31(GND); U19 6 7 8 9 10; U20 6 7 8 9 10; U21 6 7 8 9 10

### Notes on the sheet
- USB-C 1
- LOW: DFP role
  HIGH: NO ATTACH/UFP
- Mode
  HIGH - DFP (HOST ONLY)
  LOW  - UFP (DEVICE ONLY)
  DNP  - DRP (DUAL ROLE PORT)
- (near U17) 10k - 3A
  500k - 1.5A
  DNP - 900mA
- LOW: VCONN OC TRIP
  HIGH: NORMAL OPERATION
- USBC1
- Enable CC controller
- (near R115) Enable MUX
- (near R114) Both DNP - GPIO Mode
  HIGH - I2C Mode 0x67
  LOW -  I2C Mode 0x47
- ADAPTED FROM APACHE2 LICENSED WORK BY <https://github.com/antmicro/jetson-orin-baseboard>
- 1
- 2
- 3
- 4
- 5
- 6
- 7
- 8
- A
- B
- C
- D
- E
- www.antmicro.com <http://www.antmicro.com>
- Title: Jetson Orin Baseboard
- File: usb3.kicad_sch
- Sheet: /
- Antmicro Ltd
- F
- KiCad E.D.A.  kicad (5.1.4)-1
- Size: A3
- Date: 2025-01-15
- Rev: 1.3.0
- Id: 1/1

### Library data of the parts
C66 C74 = C_10u_0603: as C51 on sheet hdmi; Author: Antmicro; OldValue: C_10u_0603; Manufacturer Part Number 1: GRM188R61A106KE69D; Value: GRM188R61A106KE69D; Footprint: antmicro-footprints:C_0603_1608Metric
C67-C73 C75 = C_100n_0402: as C86 on sheet hdmi; Author: Antmicro; OldValue: C_100n_0402; Manufacturer Part Number 1: GRM155R61H104KE14D; Value: GRM155R61H104KE14D; Footprint: antmicro-footprints:C_0402_1005Metric
D10 = ESD9X5.0ST5G: Manufacturer 1: ON Semiconductor; License: Apache-2.0; Author: Antmicro; OldValue: ESD9X5.0ST5G; Manufacturer Part Number 1: ESD9X5.0ST5G; Value: ESD9X5.0ST5G; Footprint: antmicro-footprints:SOD-923
D11 = LED_G_0603_LTST-C190GKT: Manufacturer 1: Lite-On; License: Apache-2.0; Author: Antmicro; OldValue: LED_G_0603_LTST-C190GKT; Manufacturer Part Number 1: LTST-C190GKT; Value: LTST-C190GKT; Footprint: antmicro-footprints:LED_0603_1608Metric_G
J5 = USB-C_WE_632723300011: Manufacturer 1: Würth Elektronik; License: Apache-2.0; Author: Antmicro; OldValue: USB-C_WE_632723300011; Manufacturer Part Number 1: 632723300011; Value: 632723300011; Footprint: antmicro-footprints:USB-C_Receptacle_WE_632723300011
Q4 Q19 = PJE138K: as Q1 on sheet hdmi; Author: Antmicro; OldValue: PJE138K; Manufacturer Part Number 1: PJE138K_R1_00001; Value: PJE138K_R1_00001; Footprint: antmicro-footprints:SOT-523
R23 R118 R119 R124 R125 R200-R203 R245 = R_0R_0402: as R40 on sheet hdmi; Author: Antmicro; OldValue: R_0R_0402; Manufacturer Part Number 1: ERJ2GE0R00X; Value: ERJ2GE0R00X; Footprint: antmicro-footprints:R_0402_1005Metric
R24 R60 R116 R135-R138 = R_10k_0402: as R47 on sheet hdmi; Author: Antmicro; OldValue: R_10k_0402; Manufacturer Part Number 1: CR0402-FX-1002GLF; Value: CR0402-FX-1002GLF; Footprint: antmicro-footprints:R_0402_1005Metric
R61 R126 R265 R266 = R_200k_0402: Manufacturer 1: Bourns; License: Apache-2.0; Tolerance: 1%; Author: Antmicro; OldValue: R_200k_0402; Manufacturer Part Number 1: CR0402-FX-2003GLF; Value: CR0402-FX-2003GLF; Footprint: antmicro-footprints:R_0402_1005Metric
R113 = R_0R_0402_6: Manufacturer 1: Panasonic; License: Apache-2.0; Tolerance: ~; Current: 1A; Author: Antmicro; OldValue: R_0R_0402; Manufacturer Part Number 1: ERJ2GE0R00X; Value: ERJ2GE0R00X; Footprint: antmicro-footprints:R_0402_1005Metric
R114 = R_0R_0402_1: Manufacturer 1: Panasonic; License: Apache-2.0; Tolerance: ~; Current: 1A; Author: Antmicro; OldValue: R_0R_0402; Manufacturer Part Number 1: ERJ2GE0R00X; Value: ERJ2GE0R00X; Footprint: antmicro-footprints:R_0402_1005Metric
R115 = R_10k_0402_2: Manufacturer 1: Bourns; License: Apache-2.0; Tolerance: 1%; Author: Antmicro; OldValue: R_10k_0402; Manufacturer Part Number 1: CR0402-FX-1002GLF; Value: CR0402-FX-1002GLF; Footprint: antmicro-footprints:R_0402_1005Metric
R128 = R_887k_0402: Manufacturer 1: Panasonic; License: Apache-2.0; Tolerance: 1%; Author: Antmicro; OldValue: R_887k_0402; Manufacturer Part Number 1: ERJ-2RKF8873X; Value: ERJ-2RKF8873X; Footprint: antmicro-footprints:R_0402_1005Metric
R139 = R_2k2_0402: as R208 on sheet hdmi; Author: Antmicro; OldValue: R_2k2_0402; Manufacturer Part Number 1: CR0402-FX-2201GLF; Value: CR0402-FX-2201GLF; Footprint: antmicro-footprints:R_0402_1005Metric
R140 = R_470R_0402: Manufacturer 1: Bourns; License: Apache-2.0; Tolerance: 1%; Author: Antmicro; OldValue: R_470R_0402; Manufacturer Part Number 1: CR0402-FX-4700GLF; Value: CR0402-FX-4700GLF; Footprint: antmicro-footprints:R_0402_1005Metric
R184 = R_1k_0402: Manufacturer 1: Bourns; License: Apache-2.0; Tolerance: 1%; Author: Antmicro; OldValue: R_1k_0402; Manufacturer Part Number 1: CR0402-FX-1001GLF; Value: CR0402-FX-1001GLF; Footprint: antmicro-footprints:R_0402_1005Metric
TP29 TP31 TP32 = TP_0.75mm_SMD: License: Apache-2.0; Author: Antmicro; OldValue: TP_0.75mm_SMD; Value: TP_0.75mm_SMD; Footprint: antmicro-footprints:TP_SMD_0.75mm
U17 = HD3SS3220RNH: Manufacturer 1: Texas Instruments; License: Apache-2.0; Author: Antmicro; OldValue: HD3SS3220RNH; Manufacturer Part Number 1: HD3SS3220RNHT; Value: HD3SS3220RNHT; Footprint: antmicro-footprints:WQFN-30-1EP_4.6x2.6mm_P0.4mm
U18 = AP22615A_TSOT26: Manufacturer 1: Diodes Incorporated; License: Apache-2.0; Author: Antmicro; OldValue: AP22615A_TSOT26; Manufacturer Part Number 1: AP22615AWU-7; Value: AP22615AWU-7; Footprint: antmicro-footprints:TSOT23-6
U19-U21 = TPD4E05U06QDQARQ1: as U44 on sheet hdmi; Author: Antmicro; OldValue: TPD4E05U06QDQARQ1; Manufacturer Part Number 1: TPD4E05U06QDQARQ1; Value: TPD4E05U06QDQARQ1; Footprint: antmicro-footprints:USON-10_2.5x1mm_P0.5mm